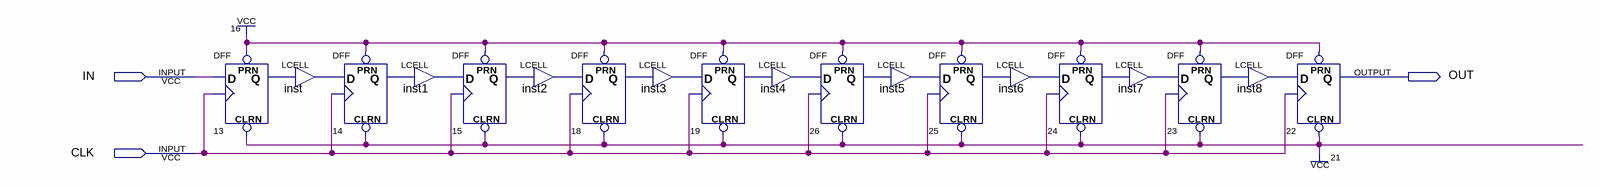
[diagram p0: schematic sheet]
// Quartus schematic sr10.bdf as structural Verilog: 19 symbols, 3 pins
module sr10 (
  input  IN,
  input  CLK,
  output OUT
);

  wire inst1_out, inst2_out, inst3_out, inst4_out, inst5_out, inst6_out, inst7_out, inst8_out, inst_out,
       n13_q, n14_q, n15_q, n18_q, n19_q, n23_q, n24_q, n25_q, n26_q;

  DFF u_13 (.CLRN(1'b1), .CLK(CLK), .D(IN), .PRN(1'b1), .Q(n13_q));
  LCELL inst (.IN(n13_q), .OUT(inst_out));
  DFF u_14 (.CLRN(1'b1), .CLK(CLK), .D(inst_out), .PRN(1'b1), .Q(n14_q));
  LCELL inst1 (.IN(n14_q), .OUT(inst1_out));
  DFF u_15 (.CLRN(1'b1), .CLK(CLK), .D(inst1_out), .PRN(1'b1), .Q(n15_q));
  DFF u_18 (.CLRN(1'b1), .CLK(CLK), .D(inst2_out), .PRN(1'b1), .Q(n18_q));
  LCELL inst2 (.IN(n15_q), .OUT(inst2_out));
  LCELL inst3 (.IN(n18_q), .OUT(inst3_out));
  DFF u_19 (.CLRN(1'b1), .CLK(CLK), .D(inst3_out), .PRN(1'b1), .Q(n19_q));
  LCELL inst4 (.IN(n19_q), .OUT(inst4_out));
  DFF u_26 (.CLRN(1'b1), .CLK(CLK), .D(inst4_out), .PRN(1'b1), .Q(n26_q));
  LCELL inst5 (.IN(n26_q), .OUT(inst5_out));
  DFF u_25 (.CLRN(1'b1), .CLK(CLK), .D(inst5_out), .PRN(1'b1), .Q(n25_q));
  DFF u_24 (.CLRN(1'b1), .CLK(CLK), .D(inst6_out), .PRN(1'b1), .Q(n24_q));
  LCELL inst6 (.IN(n25_q), .OUT(inst6_out));
  LCELL inst7 (.IN(n24_q), .OUT(inst7_out));
  DFF u_23 (.CLRN(1'b1), .CLK(CLK), .D(inst7_out), .PRN(1'b1), .Q(n23_q));
  LCELL inst8 (.IN(n23_q), .OUT(inst8_out));
  DFF u_22 (.CLRN(1'b1), .CLK(CLK), .D(inst8_out), .PRN(1'b1), .Q(OUT));
endmodule
